# Altium schematic sheet HV-Trigger.SchDoc
size A; SheetNumber: 5; SheetTotal: 8
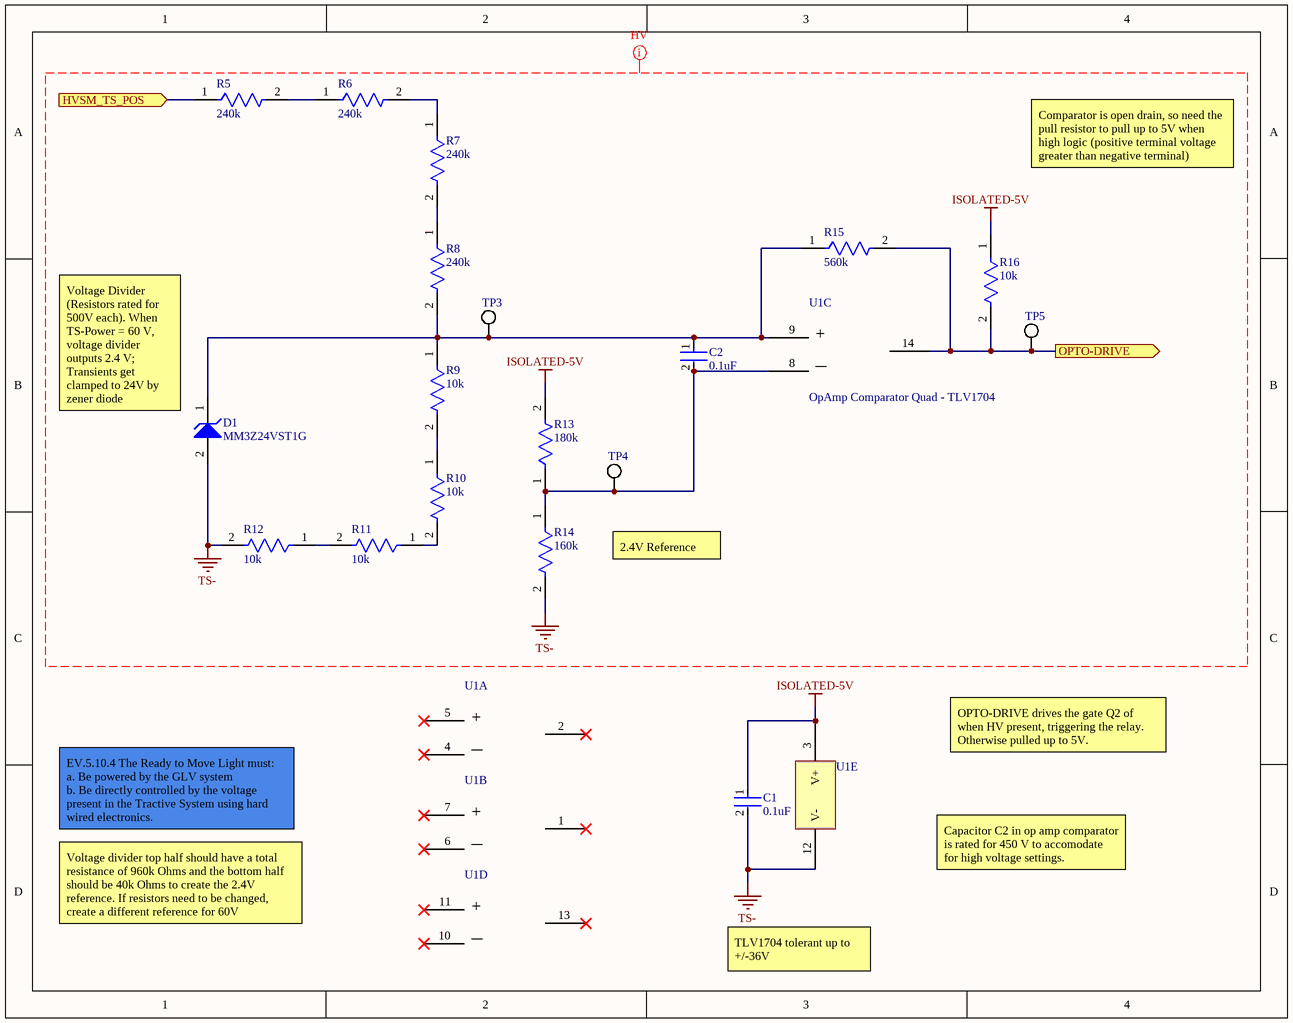
[diagram p0: HV-Trigger.SchDoc]

## Parts
C1  0.1uF  [FP-C1206C-EB-MFG]
C2  0.1uF  [FP-CGA5L-0_3-0_1-IPC_B]
D1  MM3Z24VST1G  [ONSC-SOD-323-2-477-02_V]
R5  240k  [FP-KTR18-IPC_A]
R6  240k  [FP-KTR18-IPC_A]
R7  240k  [FP-KTR18-IPC_A]
R8  240k  [FP-KTR18-IPC_A]
R9  10k  [FP-KTR18-MFG]
R10  10k  [FP-KTR18-MFG]
R11  10k  [FP-KTR18-MFG]
R12  10k  [FP-KTR18-MFG]
R13  180k  [FP-KTR18-MFG]
R14  160k  [FP-KTR18-IPC_C]
R15  560k  [FP-KTR18-IPC_C]
R16  10k  [FP-KTR18-MFG]
TP3  (no value)  [FOOTPRINT-GENERIC-TP-VIA-1MM]
TP4  (no value)  [FOOTPRINT-GENERIC-TP-VIA-1MM]
TP5  (no value)  [FOOTPRINT-GENERIC-TP-VIA-1MM]
U1  OpAmp Comparator Quad - TLV1704  [TSOP65P640X120-14N]  (value not drawn)  (parts A,B,C,D,E of 5)

## Ports
HVSM_TS_POS (in, see Top_Level[1B], HV-Connectors[2B], TSMP-Resistors[3B]), OPTO-DRIVE (out, see Top_Level[2B], Relay-Isolation[1C])

## Nets
ISOLATED-5V: C1.1 R13.2 R16.1 U1.3(V+)
TS-: C1.2 D1.2(A) R12.2 R14.2 U1.12(V-)
HVSM_TS_POS: R5.1 ; port HVSM_TS_POS
OPTO-DRIVE: R15.2 R16.2 TP5.1(TP) U1.14(3OUT) ; port OPTO-DRIVE
NetC2_1: C2.1 D1.1(K) R8.2 R9.1 R15.1 TP3.1(TP) U1.9(3IN+)
NetC2_2: C2.2 R13.1 R14.1 TP4.1(TP) U1.8(3IN-)
NetR5_2: R5.2 R6.1
NetR6_2: R6.2 R7.1
NetR7_2: R7.2 R8.1
NetR9_2: R9.2 R10.1
NetR10_2: R10.2 R11.1
NetR11_2: R11.2 R12.1

Not connected (* = marked no-connect by the designer): U1 1(2OUT)* 2(1OUT)* 4(1IN-)* 5(1IN+)* 6(2N-)* 7(2IN+)* 10(4IN-)* 11(4IN+)* 13(4OUT)*

## Layout directives
net class HV: ISOLATED-5V, TS-

## Notes on the sheet
- Comparator is open drain, so need the pull resistor to pull up to 5V when high logic (positive terminal voltage greater than negative terminal)
- (near D1) Voltage Divider (Resistors rated for 500V each). When TS-Power = 60 V, voltage divider outputs 2.4 V; Transients get clamped to 24V by zener diode
- 2.4V Reference
- OPTO-DRIVE drives the gate Q2 of when HV present, triggering the relay.
  Otherwise pulled up to 5V.
- EV.5.10.4 The Ready to Move Light must:
  a. Be powered by the GLV system
  b. Be directly controlled by the voltage present in the Tractive System using hard wired electronics.
- Capacitor C2 in op amp comparator is rated for 450 V to accomodate for high voltage settings.
- Voltage divider top half should have a total resistance of 960k Ohms and the bottom half should be 40k Ohms to create the 2.4V reference. If resistors need to be changed, create a different reference for 60V
- TLV1704 tolerant up to +/-36V
- (in symbol CMP-00000-2, part A) +; _
- (in symbol CMP-00000-2, part B) +; _
- (in symbol CMP-00000-2, part C) +; _
- (in symbol CMP-00000-2, part D) +; _

## Library data of the parts
C1 = CMP-1037-04229-2: CAP CER 0.1UF 250V X7R 1206; Manufacturer Part Number: C1206C104KARACTU; Manufacturer: KEMET; Material: Ceramic; Temperature Coefficient: 15%; Value: 0.10 μF; Tolerance: 0.1; Automotive Grade: Grade 0; Mouser Description: Multilayer Ceramic Capacitors MLCC - SMD/SMT 250volts 0.1uF X7R 10%; Height: 0.88mm; Device Class L3: Ceramic Capacitors; Temperature Range Low: -55°C; Automotive: Yes; ComponentLink2Description: Datasheet; Category: Cap; RoHS: TRUE; Temperature Range High: +150°C; Package: C1206C-EB; Device Class L2: Capacitors; Voltage Rating: 250 V; Lead Free: Yes; Temperature Characteristic: X7R; Digikey Description: CAP CER 0.1UF 250V X7R 1206; ComponentLink2URL: https://content.kemet.com/datasheets/KEM_C1007_X8R_ULTRA_150C_SMD.pdf; Device Class L1: Passive Components; Ipc Land Pattern Name: CAPC320160X78; Temperature: -55°C to +150°C; Capacitance: 0.10 μF; Octopart: https://octopart.com/c1206c104karactu-kemet-193627
C2 = CMP-08246-001673-1: Cap Ceramic 100nF 450V X7T 10% Pad SMD 1206 +125°C Automotive T/R; Min Operating Temperature: -55°C; Weight: 0.000571oz; Mount: Surface Mount; Depth: 1.6mm; Tolerance: 10%; Height: 1.6mm; Packaging: Tape and Reel; Ratings: AEC-Q200; Width: 0.063inch; Case Code (Imperial): 1206; Lead Free: Lead Free; Capacitance: 100nF; Termination: SMD/SMT; Features: Soft Termination; Thickness: 0.075inch; Package Quantity: 1; Case/Package: 1206; Length: 3.2mm; Max Operating Temperature: 125°C; Dielectric: X7T; REACH SVHC: No SVHC; Case Code (Metric): 3216; Voltage Rating: 450V; Voltage Rating (DC): 450V
D1 = CMP-1060-00674-1: Zener Voltage Regulator, 300 mW, 2-Pin SOD-323, Pb-Free, Tape and Reel; Manufacturer: On Semiconductor; PartNumber: MM3Z36VT1G; VZ Typ (V): 36; P Max (W): 0.3; ComponentLink2Description: Datasheet; ComponentLink3Description: Package Specification; ComponentLink1URL: http://www.onsemi.com/; RoHS: Pb-Free; PackageReference: SOD-323-2-477-02; Mounting Technology: Surface Mount; Packing: Tape and Reel; PackageDescription: 2-Pin SOD, Body 1.7 x 1.25 mm; ComponentLink1Description: Manufacturer URL; ComponentLink3URL: http://www.onsemi.com/pub_link/Collateral/477-02.PDF.1; DatasheetVersion: Rev. 9; PackageVersion: Rev. H, 03/2007; ComponentLink2URL: http://www.onsemi.cn/pub_link/Collateral/MM3Z2V4T1-D.PDF
R5-R8 = CMP-08839-030423-1: Res Thick Film 1206 240kΩ 1% 0.1W ±100ppm/°C Automotive Paper T/R; Resistance: 240kR; Max Power Dissipation: 250mW; Width: 0.063inch; Case/Package: 1206; Resistor Type: Thick Film; Package Quantity: 1; Case Code (Imperial): 1206; Tolerance: 1%; Height: 0.026inch; Case Code (Metric): 3216; Min Operating Temperature: -55°C; Number of Terminations: 2; Features: Automotive AEC-Q200; RoHS Compliant: Yes; Series: KTR; Packaging: Cut Tape; Temperature Coefficient: 100ppm/°C; Length: 0.126inch; Max Operating Temperature: 155°C
R9 R10 = CMP-08839-030597-1: Res Thick Film 1206 10kΩ 1% 0.1W ±100ppm/°C Automotive Paper T/R; Manufacturer: Rohm; Manufacturer Part Number: KTR18EZPF1002; Max Power Dissipation: 250mW; Resistance: 10kR; Rated Temperature: 70°C; Value: 10kR; Working Voltage: 500V; Temperature Coefficient (ppm/Cel): 100; Package Height: 0.55mm; Package Length: 3.2mm; Package Width: 1.6mm; Reference Standard: TS 16949; Temperature Coefficient: 100ppm/°C; Packaging: Tape and Reel; RoHS Compliant: Yes; Height: 0.026inch; Length: 0.126inch; Min Operating Temperature: -55°C; Case/Package: 1206; Features: Automotive AEC-Q200; Tolerance: 1%; Case Code (Metric): 3216; Series: KTR; Package Quantity: 1; Resistor Type: Thick Film; Width: 0.063inch; Max Operating Temperature: 155°C; Case Code (Imperial): 1206; Number of Terminations: 2; Supplier: Mouser; Supplier Part Number: 755-KTR18EZPF1002; RoHS: Yes; Category: Chip SMD Resistors; Stock: 9747; Pricing: 1=0.21, 10=0.105, 50=0.105, 100=0.062, 1000=0.038, 10000=0.03 (USD); Mounting Technology: Surface Mount; Pins: 2; Package Shape: Rectangular; Terminal Finish: Tin; Construction: Rectangular; Power: 250mW; Termination: Wraparound; JESD-609 Code: e3; Reach SVHC Compliant: Yes; ComponentLink1URL: https://datasheet.ciiva.com:443/pdfs/VipMasterIC/IC/ROHM/ROHM-S-A0008988694/ROHM-S-A0008988694-1.pdf?src-supplier=IHS+Markit; ComponentLink1Description: https://datasheet.ciiva.com:443/pdfs/VipMasterIC/IC/ROHM/ROHM-S-A0008988694/ROHM-S-A0008988694-1.pdf?src-supplier=IHS+Markit; ComponentLink2URL: https://datasheet.ciiva.com/2470/ktr-2470612.pdf?src-supplier=Digikey; ComponentLink2Description: https://datasheet.ciiva.com/2470/ktr-2470612.pdf?src-supplier=Digikey; ComponentLink3URL: https://datasheet.ciiva.com/2470/ktr-2470613.pdf?src-supplier=Digikey; ComponentLink3Description: https://datasheet.ciiva.com/2470/ktr-2470613.pdf?src-supplier=Digikey; ComponentLink4URL: https://datasheet.ciiva.com/2470/ktr-2470614.pdf?src-supplier=Digikey; ComponentLink4Description: https://datasheet.ciiva.com/2470/ktr-2470614.pdf?src-supplier=Digikey
R11 R12 R16 = CMP-08839-030597-1: Res Thick Film 1206 10kΩ 1% 0.1W ±100ppm/°C Automotive Paper T/R; Max Power Dissipation: 250mW; Resistance: 10kR; Temperature Coefficient: 100ppm/°C; Packaging: Tape and Reel; RoHS Compliant: Yes; Height: 0.026inch; Length: 0.126inch; Min Operating Temperature: -55°C; Case/Package: 1206; Features: Automotive AEC-Q200; Tolerance: 1%; Case Code (Metric): 3216; Series: KTR; Package Quantity: 1; Resistor Type: Thick Film; Width: 0.063inch; Max Operating Temperature: 155°C; Case Code (Imperial): 1206; Number of Terminations: 2
R13 = CMP-08839-001270-1: Res Thick Film 1206 180kΩ 1% 0.1W ±100ppm/°C Automotive Paper T/R; Resistance: 180kR; Max Power Dissipation: 250mW; RoHS Compliant: Yes; Series: KTR; Features: Automotive AEC-Q200; Tolerance: 1%; Case/Package: 1206; Packaging: Cut Tape; Height: 0.026inch; Case Code (Imperial): 1206; Min Operating Temperature: -55°C; Package Quantity: 5000; Case Code (Metric): 3216; Max Operating Temperature: 155°C; Width: 0.063inch; Length: 0.126inch; Temperature Coefficient: 100ppm/°C; Number of Terminations: 2; Resistor Type: Thick Film
R14 = CMP-08839-002259-1: Res Thick Film 1206 160kΩ 1% 0.1W ±100ppm/°C Automotive Paper T/R; Resistance: 160kR; Max Power Dissipation: 250mW; Package Quantity: 5000; Packaging: Cut Tape; Case Code (Metric): 3216; Temperature Coefficient: 100ppm/°C; Width: 0.063inch; Features: Automotive AEC-Q200; Tolerance: 1%; Resistor Type: Thick Film; Length: 0.126inch; Number of Terminations: 2; Max Operating Temperature: 155°C; Height: 0.026inch; Min Operating Temperature: -55°C; Case/Package: 1206; RoHS Compliant: Yes; Series: KTR; Case Code (Imperial): 1206
R15 = CMP-08839-031201-1: Res Thick Film 1206 560kΩ 1% 0.1W ±100ppm/°C Automotive Paper T/R; Max Power Dissipation: 250mW; Resistance: 560kR; Min Operating Temperature: -55°C; Series: KTR; Packaging: Tape and Reel; Resistor Type: Thick Film; Features: Automotive AEC-Q200; Tolerance: 1%; Max Operating Temperature: 155°C; RoHS Compliant: Yes; Case/Package: 1206; Temperature Coefficient: 100ppm/°C; Case Code (Metric): 3216; Case Code (Imperial): 1206; Number of Terminations: 2
TP3-TP5 = CMP-025-000000-1: Source: Generic.SchLib; Design Item ID: Misc-Generic-TP
U1 = CMP-00000-2: IC COMPARATOR QUAD 14TSSOP; Quiescent Current: 75uA; Output Current: 20mA; Max Input Current: 15nA; Number of Elements: 4; Propagation Delay: 560ns; Input Offset Voltage (Vos): 3.5mV; Min Operating Temperature: -40°C; Type: General Purpose; Packaging: Tape and Reel; Number of Pins: 14; Mount: Surface Mount; Input Bias Current: 15nA; RoHS Compliant: Yes; Case/Package: TSSOP; Lead Free: Lead Free; Number of Channels: 4; Max Operating Temperature: 125°C